# Altium project RC_Car_Test_1.PrjPcb
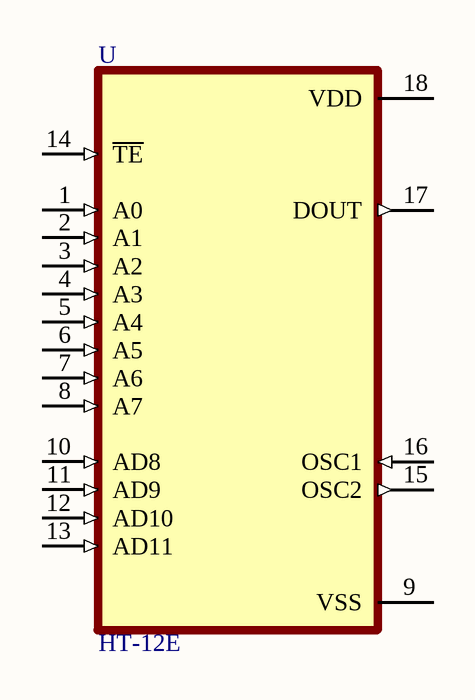
[diagram p0: Sheet1.SchDoc]
1 sheet, 1 parts. Net scope: global (net labels, ports and power ports of the same name join across sheets).

## Sheet Sheet1.SchDoc
size B; SheetNumber: 1; SheetTotal: 1

### Parts
U  HT-12E  [DIP794W46P254L2337H495Q18]

### Nets

Not connected (* = marked no-connect by the designer): U 1(A0) 2(A1) 3(A2) 4(A3) 5(A4) 6(A5) 7(A6) 8(A7) 9(VSS) 10(AD8) 11(AD9) 12(AD10) 13(AD11) 14(~{TE}) 15(OSC2) 16(OSC1) 17(DOUT) 18(VDD)

### Library data of the parts
U = HT-12E: IC: remote control encoder; DIP18; 2.4Ã·12VDC; MF: Holtek; MP: HT12E; Value: *; SnapEDA_Link: https://www.snapeda.com/parts/HT12E/Holtek/view-part/51226/?ref=snap; Availability: Unavailable; Price: None; Package: DIP-18 Holtek